# Altium schematic sheet SCH Driver RL.SchDoc
size A4; SheetNumber: 1; SheetTotal: 1
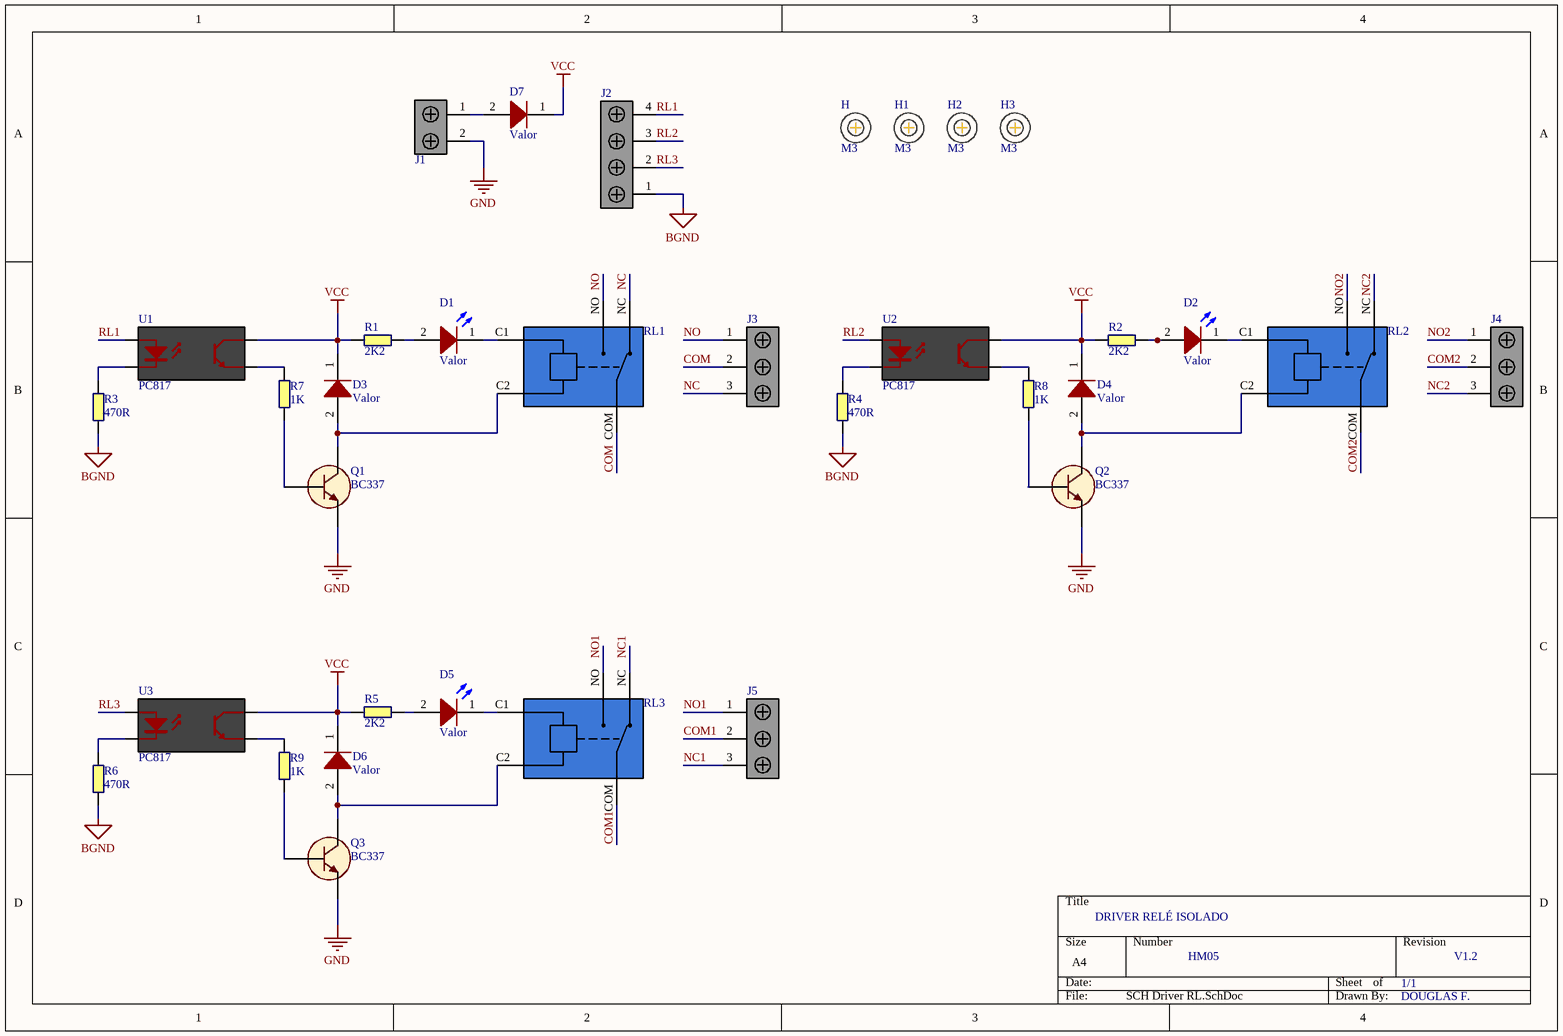
[diagram p0: SCH Driver RL.SchDoc]

## Parts
D1  Valor  [LED 3MM]
D2  Valor  [LED 3MM]
D3  Valor  [1N4148 DO-35]
D4  Valor  [1N4148 DO-35]
D5  Valor  [LED 3MM]
D6  Valor  [1N4148 DO-35]
D7  Valor  [1N4007 DO-41]
H  M3  [Parafuso M3]
H1  M3  [Parafuso M3]
H2  M3  [Parafuso M3]
H3  M3  [Parafuso M3]
J1  Conector 2v Phoenix  [Terminal block 5mm 2V]  (value not drawn)
J2  TERMINAL BLOCK 4V  [Terminal block 5mm 4V]  (value not drawn)
J3  Conector 2v Phoenix  [Terminal block 5mm 3V]  (value not drawn)
J4  Conector 2v Phoenix  [Terminal block 5mm 3V]  (value not drawn)
J5  Conector 2v Phoenix  [Terminal block 5mm 3V]  (value not drawn)
Q1  BC337  [TO 92]
Q2  BC337  [TO 92]
Q3  BC337  [TO 92]
R1  2K2  [RES 1/4 PTH]
R2  2K2  [RES 1/4 PTH]
R3  470R  [RES 1/4 PTH]
R4  470R  [RES 1/4 PTH]
R5  2K2  [RES 1/4 PTH]
R6  470R  [RES 1/4 PTH]
R7  1K  [RES 1/4 PTH]
R8  1K  [RES 1/4 PTH]
R9  1K  [RES 1/4 PTH]
RL1  Relé 12v 5p  [RELAY]  (value not drawn)
RL2  Relé 12v 5p  [RELAY]  (value not drawn)
RL3  Relé 12v 5p  [RELAY]  (value not drawn)
U1  PC817  [PC817 DIP-4]
U2  PC817  [PC817 DIP-4]
U3  PC817  [PC817 DIP-4]

## Nets
BGND: J2.1 R3.1 R4.1 R6.1
GND: J1.2 Q1.3(E) Q2.3(E) Q3.3(E)
VCC: D3.1 D4.1 D6.1 D7.1 R1.2 R2.2 R5.2 U1.4(C) U2.4(C) U3.4(C)
COM: J3.2 RL1.COM
COM1: J5.2 RL3.COM
COM2: J4.2 RL2.COM
NC: J3.3 RL1.NC
NC1: J5.3 RL3.NC
NC2: J4.3 RL2.NC
NO: J3.1 RL1.NO
NO1: J5.1 RL3.NO
NO2: J4.1 RL2.NO
RL1: J2.4 U1.1(A)
RL2: J2.3 U2.1(A)
RL3: J2.2 U3.1(A)
NetD1_1: D1.1 RL1.C1(COIL_1)
NetD1_2: D1.2 R1.1
NetD2_1: D2.1 RL2.C1(COIL_1)
NetD2_2: D2.2 R2.1
NetD3_2: D3.2 Q1.1(C) RL1.C2(COIL_2)
NetD4_2: D4.2 Q2.1(C) RL2.C2(COIL_2)
NetD5_1: D5.1 RL3.C1(COIL_1)
NetD5_2: D5.2 R5.1
NetD6_2: D6.2 Q3.1(C) RL3.C2(COIL_2)
NetD7_2: D7.2 J1.1
NetQ1_2: Q1.2(B) R7.1
NetQ2_2: Q2.2(B) R8.1
NetQ3_2: Q3.2(B) R9.1
NetR3_2: R3.2 U1.2(K)
NetR4_2: R4.2 U2.2(K)
NetR6_2: R6.2 U3.2(K)
NetR7_2: R7.2 U1.3(E)
NetR8_2: R8.2 U2.3(E)
NetR9_2: R9.2 U3.3(E)

## Notes on the sheet
- DRIVER RELÉ ISOLADO
- HM05
- 1/1
- V1.2
- DOUGLAS F.

## Library data of the parts
D1 D2 D5 = LED: Typical RED, GREEN, YELLOW, AMBER GaAs LED; Published: 8-Jun-2000; LatestRevisionDate: 17-Jul-2002; LatestRevisionNote: Re-released for DXP Platform.; PackageVersion: Feb-2002; PackageReference: 3.2X1.6X1.1; Publisher: Altium Limited; PackageDescription: SM LED; 2 Flat Leads
D3 D4 D6 = DIODO 1N4148: Diodo rapido; Published: 8-Jun-2000; LatestRevisionDate: 17-Jul-2002; LatestRevisionNote: Re-released for DXP Platform.; DatasheetVersion: 1997; PackageReference: DO-35; Publisher: Altium Limited; PackageDescription: Diode, Axial; Body 3.8 x 1.9 mm (LxDia. max), Lead Dia. 0.53 mm (max); Code_JEDEC: DO-204-AH; ComponentLink1Description: Manufacturer Link; ComponentLink1URL: http://www.fairchildsemi.com/; ComponentLink2Description: Datasheet; ComponentLink2URL: http://www.fairchildsemi.com/ds/1N%2F1N4148.pdf
D7 = DIODO 1N4007: Diodo rapido; Published: 8-Jun-2000; LatestRevisionDate: 17-Jul-2002; LatestRevisionNote: Re-released for DXP Platform.; DatasheetVersion: 1997; PackageReference: DO-35; Publisher: Altium Limited; PackageDescription: Diode, Axial; Body 3.8 x 1.9 mm (LxDia. max), Lead Dia. 0.53 mm (max); Code_JEDEC: DO-204-AH; ComponentLink1Description: Manufacturer Link; ComponentLink1URL: http://www.fairchildsemi.com/; ComponentLink2Description: Datasheet; ComponentLink2URL: http://www.fairchildsemi.com/ds/1N%2F1N4148.pdf
H H1-H3 = Furo M3
J1 = TERMINAL BLOCK 2V: Block, Terminal; 6 A; 63 V; 5 mm; 26 to 20 AWG; 2; Screw; Soldering; 1.5 kV; Manufacturer: Phoenix Contact; Manufacturer Part Number: 1725656; Current Rating: 6A; Voltage Rating: 125V; Number of Positions: 2; Number of Levels: 1; Connector Type: Screw,PCB,Terminal Block; Max Supply Voltage: 63V; Pitch: 2.54mm; Wire Gauge (Max): 26AWG; Wire Gauge (Min): 20AWG; Stripping Length: 4.5mm; Approvals: UL,CSA,cULus,EAC; RoHS: Yes; Category: Terminal Blocks; Stock 1: 29866; Pricing 1: 1=1,94000, 10=1,76000, 50=1,69000, 100=1,64000, 1000=1,27000, 10000=1,17000 (USD); Mount: Through Hole; Number of Pins: 2; Contact Material: Tin; Weight: 0.022575oz; Housing Material: Polyamide; Color: Green; Housing Color: Green; Insulation Material: Nylon; Package Quantity: 50; Packaging: Bulk; Termination: Solder; Series: MPT; Max Current Rating: 6A; Number of Contacts: 2; Number of Rows: 1; Number of Positions Per Level: 2; Current: 6A; Voltage: 125V; Orientation: Straight; Number of Poles: 2; Number of Circuits: 2; Length: 5.54mm; Width: 12mm; Height: 6.2mm; Depth: 6.2mm; Wire/Cable Gauge: 26AWG; Radiation Hardening: No; RoHS Compliant: Yes; Lead Free: Lead Free; Flammability Rating: UL94 V-0; Reach SVHC Compliant: Yes; ComponentLink1URL: https://datasheet.ciiva.com/16071/1725656-16071846.pdf?src-supplier=Onlinecomponents.com; ComponentLink1Description: https://datasheet.ciiva.com/16071/1725656-16071846.pdf?src-supplier=Onlinecomponents.com; ComponentLink2URL: https://datasheet.ciiva.com/15169/getdatasheetpartid-199323-15169849.pdf?src-supplier=Verical; ComponentLink2Description: https://datasheet.ciiva.com/15169/getdatasheetpartid-199323-15169849.pdf?src-supplier=Verical; ComponentLink3URL: https://datasheet.ciiva.com/823/1725656-823793.pdf?src-supplier=Digi-Key; ComponentLink3Description: https://datasheet.ciiva.com/823/1725656-823793.pdf?src-supplier=Digi-Key; ComponentLink4URL: https://datasheet.ciiva.com/1120/319957-1120510.pdf?src-supplier=Farnell; ComponentLink4Description: https://datasheet.ciiva.com/1120/319957-1120510.pdf?src-supplier=Farnell; ComponentLink5URL: https://datasheet.ciiva.com/26340/788052-da-01-en-100ntklemme-1725656-250-st-26340907.pdf?src-supplier=Conrad; ComponentLink5Description: https://datasheet.ciiva.com/26340/788052-da-01-en-100ntklemme-1725656-250-st-26340907.pdf?src-supplier=Conrad; Supplier Part Number 1: 651-1725656
J2 = TERMINAL BLOCK 4V: Block, Terminal; 6 A; 63 V; 5 mm; 26 to 20 AWG; 4 Screw; Soldering; 1.5 kV
J3-J5 = TERMINAL BLOCK 3V: Block, Terminal; 6 A; 63 V; 5 mm; 26 to 20 AWG; 3; Screw; Soldering; 1.5 kV; Manufacturer: Phoenix Contact; Manufacturer Part Number: 1725656; Current Rating: 6A; Voltage Rating: 125V; Number of Positions: 2; Number of Levels: 1; Connector Type: Screw,PCB,Terminal Block; Max Supply Voltage: 63V; Pitch: 2.54mm; Wire Gauge (Max): 26AWG; Wire Gauge (Min): 20AWG; Stripping Length: 4.5mm; Approvals: UL,CSA,cULus,EAC; RoHS: Yes; Category: Terminal Blocks; Stock 1: 29866; Pricing 1: 1=1,94000, 10=1,76000, 50=1,69000, 100=1,64000, 1000=1,27000, 10000=1,17000 (USD); Mount: Through Hole; Number of Pins: 2; Contact Material: Tin; Weight: 0.022575oz; Housing Material: Polyamide; Color: Green; Housing Color: Green; Insulation Material: Nylon; Package Quantity: 50; Packaging: Bulk; Termination: Solder; Series: MPT; Max Current Rating: 6A; Number of Contacts: 2; Number of Rows: 1; Number of Positions Per Level: 2; Current: 6A; Voltage: 125V; Orientation: Straight; Number of Poles: 2; Number of Circuits: 2; Length: 5.54mm; Width: 12mm; Height: 6.2mm; Depth: 6.2mm; Wire/Cable Gauge: 26AWG; Radiation Hardening: No; RoHS Compliant: Yes; Lead Free: Lead Free; Flammability Rating: UL94 V-0; Reach SVHC Compliant: Yes; ComponentLink1URL: https://datasheet.ciiva.com/16071/1725656-16071846.pdf?src-supplier=Onlinecomponents.com; ComponentLink1Description: https://datasheet.ciiva.com/16071/1725656-16071846.pdf?src-supplier=Onlinecomponents.com; ComponentLink2URL: https://datasheet.ciiva.com/15169/getdatasheetpartid-199323-15169849.pdf?src-supplier=Verical; ComponentLink2Description: https://datasheet.ciiva.com/15169/getdatasheetpartid-199323-15169849.pdf?src-supplier=Verical; ComponentLink3URL: https://datasheet.ciiva.com/823/1725656-823793.pdf?src-supplier=Digi-Key; ComponentLink3Description: https://datasheet.ciiva.com/823/1725656-823793.pdf?src-supplier=Digi-Key; ComponentLink4URL: https://datasheet.ciiva.com/1120/319957-1120510.pdf?src-supplier=Farnell; ComponentLink4Description: https://datasheet.ciiva.com/1120/319957-1120510.pdf?src-supplier=Farnell; ComponentLink5URL: https://datasheet.ciiva.com/26340/788052-da-01-en-100ntklemme-1725656-250-st-26340907.pdf?src-supplier=Conrad; ComponentLink5Description: https://datasheet.ciiva.com/26340/788052-da-01-en-100ntklemme-1725656-250-st-26340907.pdf?src-supplier=Conrad; Supplier Part Number 1: 651-1725656
R1-R9 = RESISTOR 1/4W: Resistor; Published: 8-Jun-2000; LatestRevisionDate: 17-Jul-2002; LatestRevisionNote: Re-released for DXP Platform.; PackageReference: AXIAL-0.4; Publisher: Altium Limited; PackageDescription: Axial Device, Thru-Hole; 2 Leads; 0.4 in Pin Spacing